# EAGLE design 4-UniverseOutV2 (EAGLE 6.6.0)
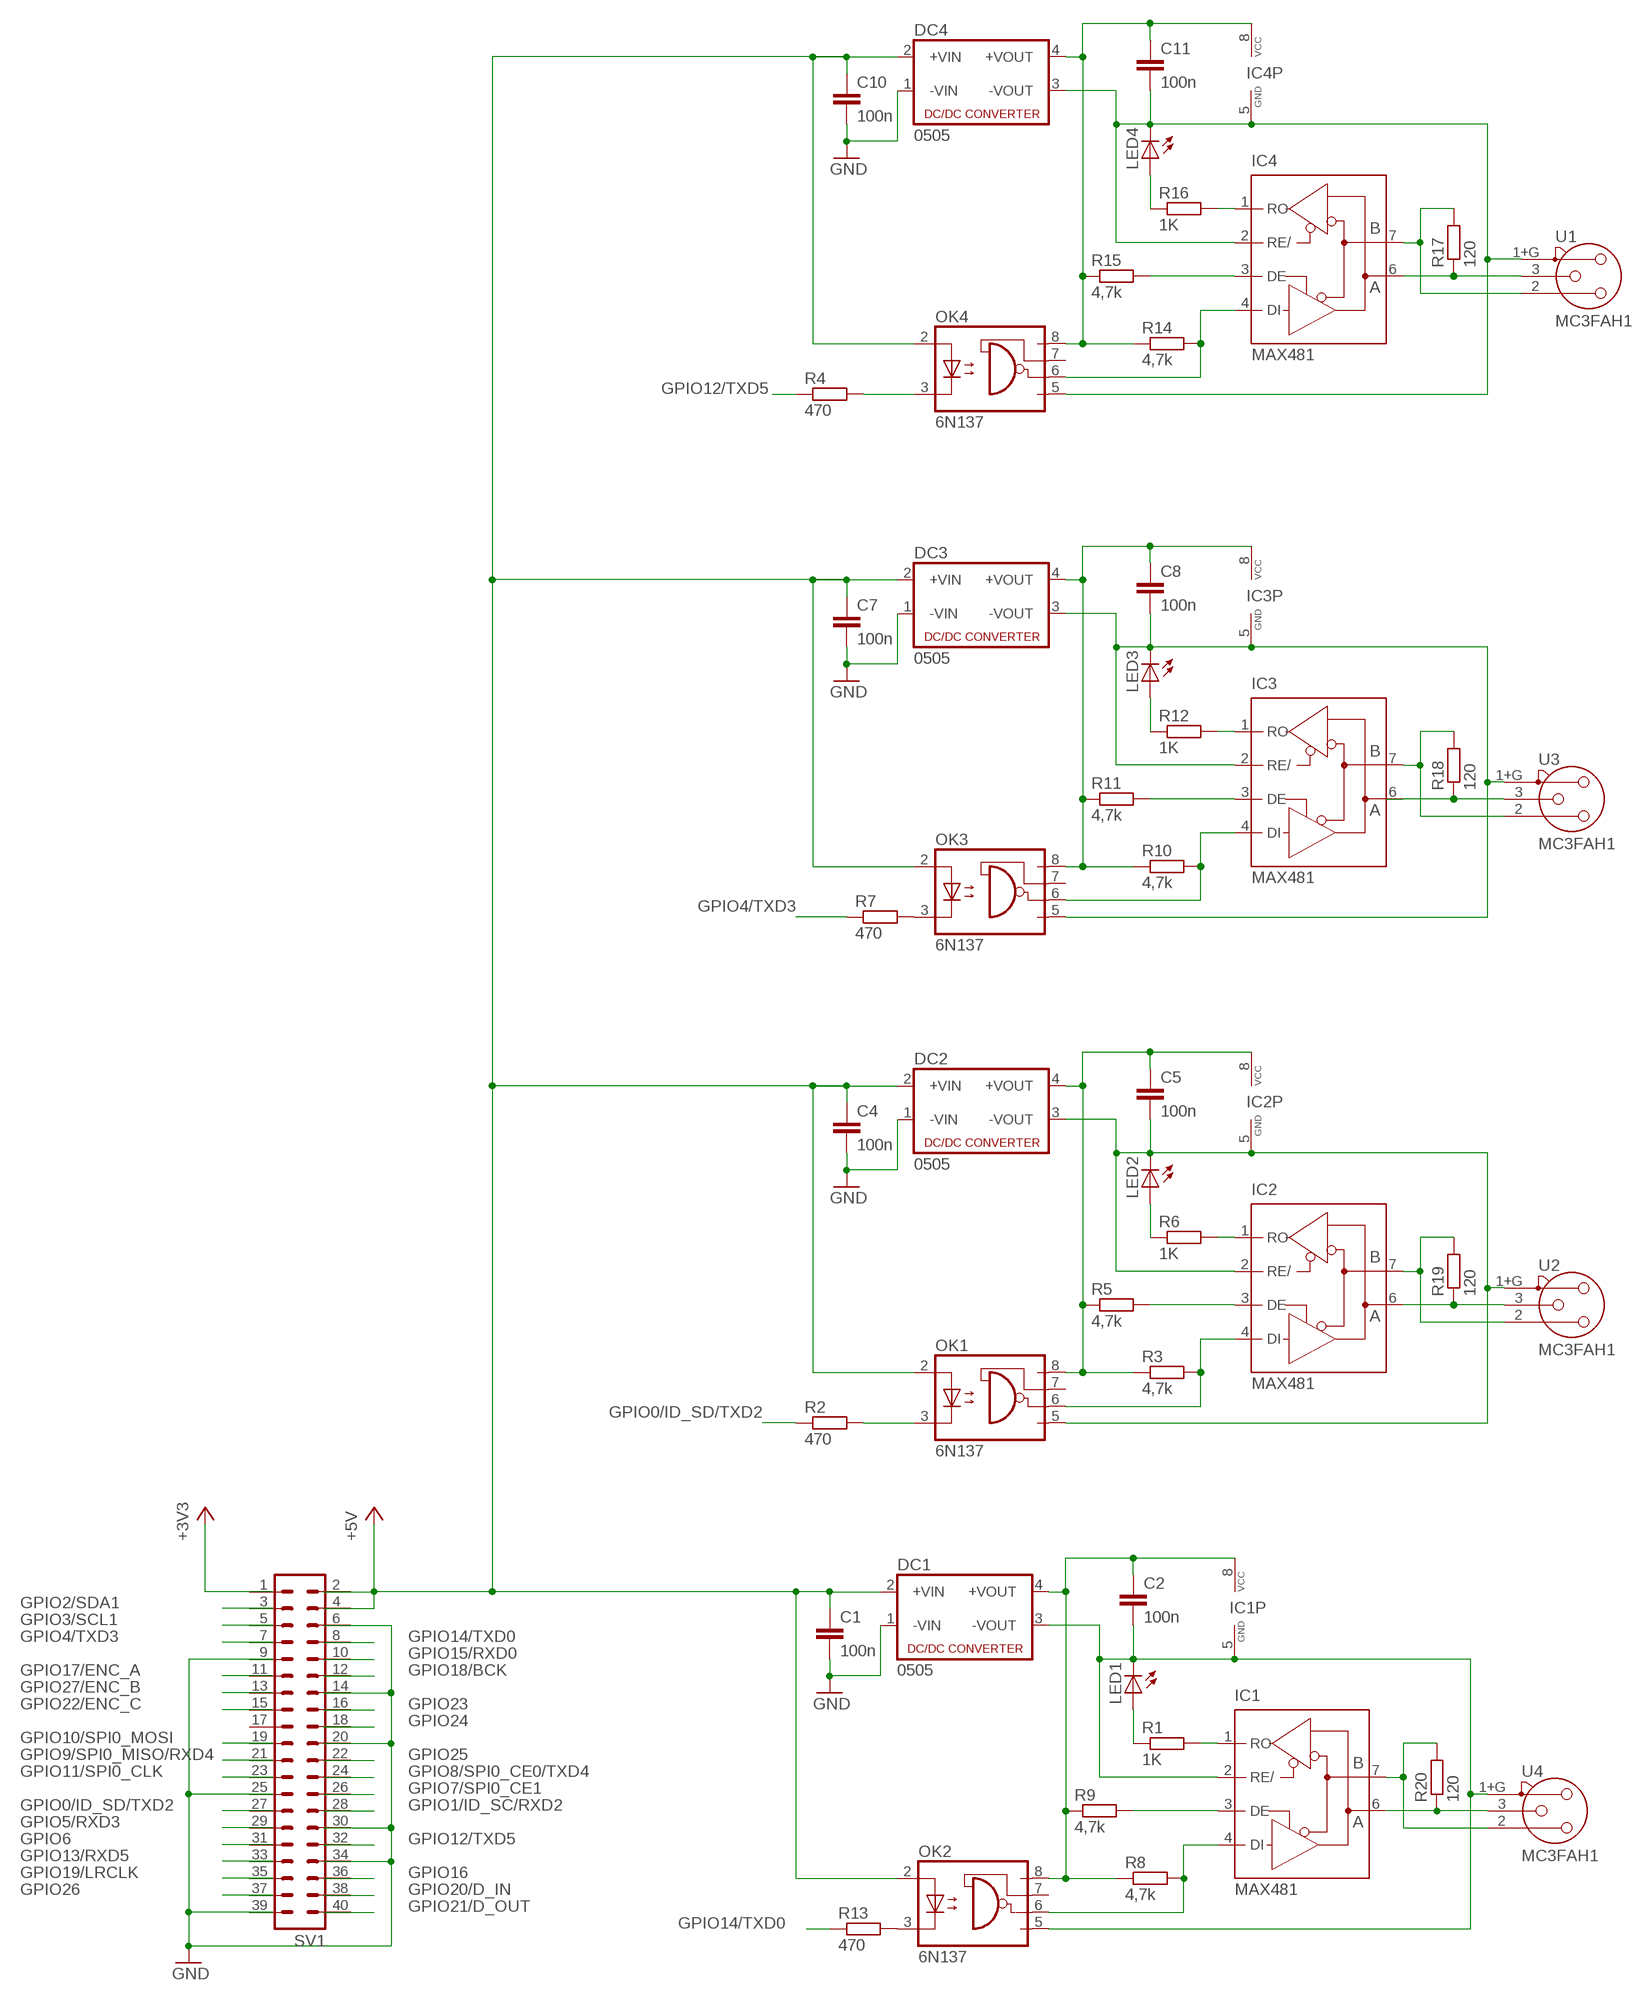
[diagram p0: schematic, sheet 1]

## Parts
C1  100n  C5/3  [C5B3]
C2  100n  C7.5/3  [C7.5B3]
C4  100n  C5/3  [C5B3]
C5  100n  C7.5/3  [C7.5B3]
C7  100n  C5/3  [C5B3]
C8  100n  C7.5/3  [C7.5B3]
C10  100n  C5/3  [C5B3]
C11  100n  C7.5/3  [C7.5B3]
DC1  0505  NME  [NME]
DC2  0505  NME  [NME]
DC3  0505  NME  [NME]
DC4  0505  NME  [NME]
IC1  MAX481  MAX481CPA  [DIL08]
IC2  MAX481  MAX481CPA  [DIL08]
IC3  MAX481  MAX481CPA  [DIL08]
IC4  MAX481  MAX481CPA  [DIL08]
LED1  LED3MM  [LED3MM]
LED2  LED3MM  [LED3MM]
LED3  LED3MM  [LED3MM]
LED4  LED3MM  [LED3MM]
OK1  6N137  [DIL08]
OK2  6N137  [DIL08]
OK3  6N137  [DIL08]
OK4  6N137  [DIL08]
R1  1K  R-EU_0204/7  [0204/7]
R2  470  R-EU_0204/7  [0204/7]
R3  4,7k  R-EU_0204/7  [0204/7]
R4  470  R-EU_0204/7  [0204/7]
R5  4,7k  R-EU_0204/7  [0204/7]
R6  1K  R-EU_0204/7  [0204/7]
R7  470  R-EU_0204/7  [0204/7]
R8  4,7k  R-EU_0204/7  [0204/7]
R9  4,7k  R-EU_0204/7  [0204/7]
R10  4,7k  R-EU_0204/7  [0204/7]
R11  4,7k  R-EU_0204/7  [0204/7]
R12  1K  R-EU_0204/7  [0204/7]
R13  470  R-EU_0204/7  [0204/7]
R14  4,7k  R-EU_0204/7  [0204/7]
R15  4,7k  R-EU_0204/7  [0204/7]
R16  1K  R-EU_0204/7  [0204/7]
R17  120  R-EU_0207/2V  [0207/2V]
R18  120  R-EU_0207/2V  [0207/2V]
R19  120  R-EU_0207/2V  [0207/2V]
R20  120  R-EU_0207/2V  [0207/2V]
SV1  ML40  [ML40]
U1  MC3FAH1  [NC3FAH1]
U2  MC3FAH1  [NC3FAH1]
U3  MC3FAH1  [NC3FAH1]
U4  MC3FAH1  [NC3FAH1]

## Nets
+3V3: SV1.1
+5V: C1.1 C4.1 C7.1 C10.1 DC1.2(+VIN) DC2.2(+VIN) DC3.2(+VIN) DC4.2(+VIN) OK1.2(A) OK2.2(A) OK3.2(A) OK4.2(A) SV1.2 SV1.4
+5V_EXT: C2.1 DC1.4(+VOUT) IC1.8(VCC) OK2.8(VCC) R8.1 R9.1
+5V_EXT1: C5.1 DC2.4(+VOUT) IC2.8(VCC) OK1.8(VCC) R3.1 R5.1
+5V_EXT2: C8.1 DC3.4(+VOUT) IC3.8(VCC) OK3.8(VCC) R10.1 R11.1
+5V_EXT3: C11.1 DC4.4(+VOUT) IC4.8(VCC) OK4.8(VCC) R14.1 R15.1
GND: C1.2 C4.2 C7.2 C10.2 DC1.1(-VIN) DC2.1(-VIN) DC3.1(-VIN) DC4.1(-VIN) SV1.6 SV1.9 SV1.14 SV1.20 SV1.25 SV1.30 SV1.34 SV1.39
GND_EXT: C2.2 DC1.3(-VOUT) IC1.2(RE/) IC1.5(GND) LED1.K(C) OK2.5(GND) U4.1+G
GND_EXT1: C5.2 DC2.3(-VOUT) IC2.2(RE/) IC2.5(GND) LED2.K(C) OK1.5(GND) U2.1+G
GND_EXT2: C8.2 DC3.3(-VOUT) IC3.2(RE/) IC3.5(GND) LED3.K(C) OK3.5(GND) U3.1+G
GND_EXT3: C11.2 DC4.3(-VOUT) IC4.2(RE/) IC4.5(GND) LED4.K(C) OK4.5(GND) U1.1+G
GPIO0/ID_SD/TXD2: R2.1 SV1.27
GPIO1/ID_SC/RXD2: SV1.28
GPIO2/SDA1: SV1.3
GPIO3/SCL1: SV1.5
GPIO4/TXD3: R7.1 SV1.7
GPIO5/RXD3: SV1.29
GPIO6: SV1.31
GPIO7/SPI0_CE1: SV1.26
GPIO8/SPI0_CE0/TXD4: SV1.24
GPIO9/SPI0_MISO/RXD4: SV1.21
GPIO10/SPI0_MOSI: SV1.19
GPIO11/SPI0_CLK: SV1.23
GPIO12/TXD5: R4.1 SV1.32
GPIO13/RXD5: SV1.33
GPIO14/TXD0: R13.1 SV1.8
GPIO15/RXD0: SV1.10
GPIO16: SV1.36
GPIO17/ENC_A: SV1.11
GPIO18/BCK: SV1.12
GPIO19/LRCLK: SV1.35
GPIO20/D_IN: SV1.38
GPIO21/D_OUT: SV1.40
GPIO22/ENC_C: SV1.15
GPIO23: SV1.16
GPIO24: SV1.18
GPIO25: SV1.22
GPIO26: SV1.37
GPIO27/ENC_B: SV1.13
N$1: OK4.3(C) R4.2
N$2: OK3.3(C) R7.2
N$3: OK1.3(C) R2.2
N$4: OK2.3(C) R13.2
N$36: IC1.3(DE) R9.2
N$87: IC1.4(DI) OK2.6(VO) R8.2
N$161: IC1.6(A) R20.1 U4.3
N$162: IC1.7(B) R20.2 U4.2
N$164: IC1.1(RO) R1.2
N$165: LED1.A R1.1
N$167: IC2.3(DE) R5.2
N$168: IC2.4(DI) OK1.6(VO) R3.2
N$169: IC2.6(A) R19.1 U2.3
N$170: IC2.7(B) R19.2 U2.2
N$172: IC2.1(RO) R6.2
N$173: LED2.A R6.1
N$177: IC3.3(DE) R11.2
N$178: IC3.4(DI) OK3.6(VO) R10.2
N$179: IC3.6(A) R18.1 U3.3
N$181: IC3.7(B) R18.2 U3.2
N$187: IC3.1(RO) R12.2
N$188: LED3.A R12.1
N$191: IC4.3(DE) R15.2
N$192: IC4.4(DI) OK4.6(VO) R14.2
N$193: IC4.6(A) R17.1 U1.3
N$194: IC4.7(B) R17.2 U1.2
N$196: IC4.1(RO) R16.2
N$197: LED4.A R16.1
Unconnected: OK1.7(VE) OK2.7(VE) OK3.7(VE) OK4.7(VE) SV1.17

## Library data of the parts
C1 C2 C4 C5 C7 C8 C10 C11 = capacitor-wima:C: CAPACITOR naming: grid - package width
DC1-DC4 = dc-dc-converter:NME: DC-DC CONVERTER; MF: C & D TECHNOLOGIES, INC; MPN: NME1205D; OC_FARNELL: 1021466; OC_NEWARK: 98B8198
IC1-IC4 = maxim:MAX481CPA: RS485 TRANSEIVER; MPN: MAX481CPA+; OC_FARNELL: unknown; OC_NEWARK: 99K3445
LED1-LED4 = led:LED: LED OSRAM: - CHIPLED LG R971, LG N971, LY N971, LG Q971, LY Q971, LO R971, LY R971 LH N974, LH R974 LS Q976, LO Q976, LY Q976 LO Q996 - Hyper CHIPLED LW Q18S LB Q993, LB Q99A, LB R99A - SideLED LS A670, LO A670, LY A670, LG A670, LP A670 LB A673, LV A673, LT A673, LW A673 LH A674 LY A675 LS A676, LA A676, LO A676, LY A676, LW A676 LS A679, LY A679, LG A679 - Hyper Micro SIDELED® LS Y876, LA Y876, LO Y876, LY Y876 LT Y87S - SmartLED LW L88C, LW L88S LB L89C, LB L89S, LG L890 LS L89K, LO L89K, LY L89K LS L896, LA L896, LO L896, LY L896 - TOPLED LS T670, LO T670, LY T670, LG T670, LP T670 LSG T670, LSP T670, LSY T670, LOP T670, LYG T670 LG T671, LOG T671, LSG T671 LB T673, LV T673, LT T673, LW T673 LH T674 LS T676, LA T676, LO T676, LY T676, LB T676, LH T676, LSB T676, LW T676 LB T67C, LV T67C, LT T67C, LS T67K, LO T67K, LY T67K, LW E67C LS E67B, LA E67B, LO E67B, LY E67B, LB E67C, LV E67C, LT E67C LW T67C LS T679, LY T679, LG T679 LS T770, LO T770, LY T770, LG T770, LP T770 LB T773, LV T773, LT T773, LW T773 LH T774 LS E675, LA E675, LY E675, LS T675 LS T776, LA T776, LO T776, LY T776, LB T776 LHGB T686 LT T68C, LB T68C - Hyper Mini TOPLED® LB M676 - Mini TOPLED Santana® LG M470 LS M47K, LO M47K, LY M47K Source: http://www.osram.convergy.de LUXEON: - LUMILED® LXK2-PW12-R00, LXK2-PW12-S00, LXK2-PW14-U00, LXK2-PW14-V00 LXK2-PM12-R00, LXK2-PM12-S00, LXK2-PM14-U00 LXK2-PE12-Q00, LXK2-PE12-R00, LXK2-PE12-S00, LXK2-PE14-T00, LXK2-PE14-U00 LXK2-PB12-K00, LXK2-PB12-L00, LXK2-PB12-M00, LXK2-PB14-N00, LXK2-PB14-P00, LXK2-PB14-Q00 LXK2-PR12-L00, LXK2-PR12-M00, LXK2-PR14-Q00, LXK2-PR14-R00 LXK2-PD12-Q00, LXK2-PD12-R00, LXK2-PD12-S00 LXK2-PH12-R00, LXK2-PH12-S00 LXK2-PL12-P00, LXK2-PL12-Q00, LXK2-PL12-R00 Source: www.luxeon.com KINGBRIGHT: KA-3528ASYC Source: www.kingbright.com
OK1-OK4 = optocoupler:6N137: MOTOROLA OPTO COUPLER; MPN: 6N137; OC_FARNELL: 1328376; OC_NEWARK: 52M1895
R1-R20 = resistor:R-EU_: RESISTOR, European symbol
SV1 = con-ml:ML40: HARTING; OC_FARNELL: unknown; OC_NEWARK: unknown
U1-U4 = con-neutrik_ag:MC3?: Neutrik Audio Connector XLR SERIES Stereo 1/4" jack Source: www.neutrik.com/; OC_FARNELL: unknown; OC_NEWARK: unknown

## Board
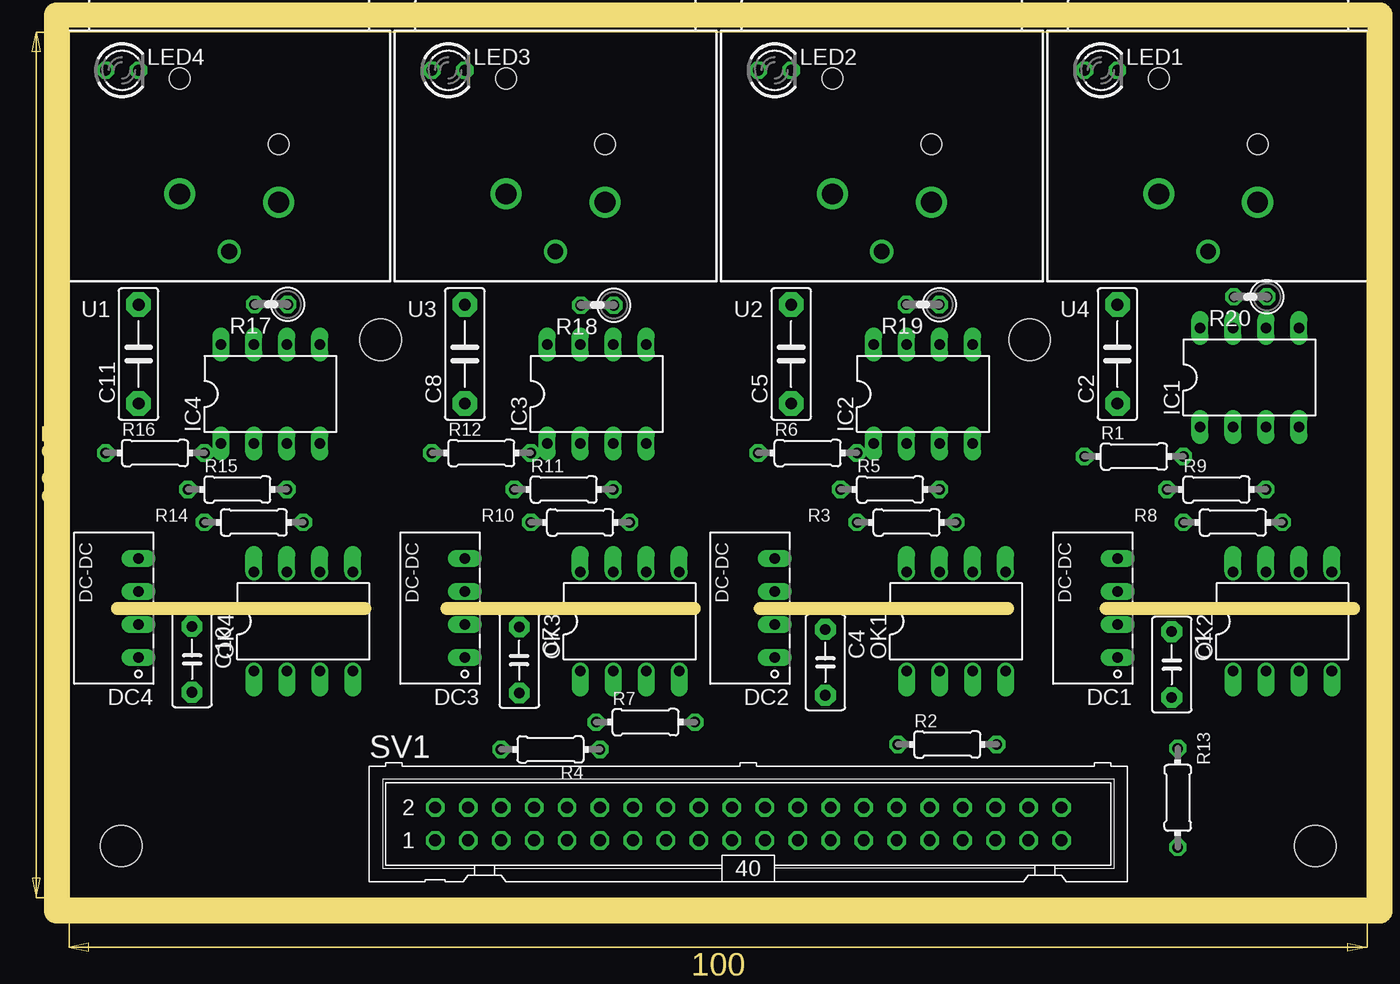
[diagram p1: board, top side]
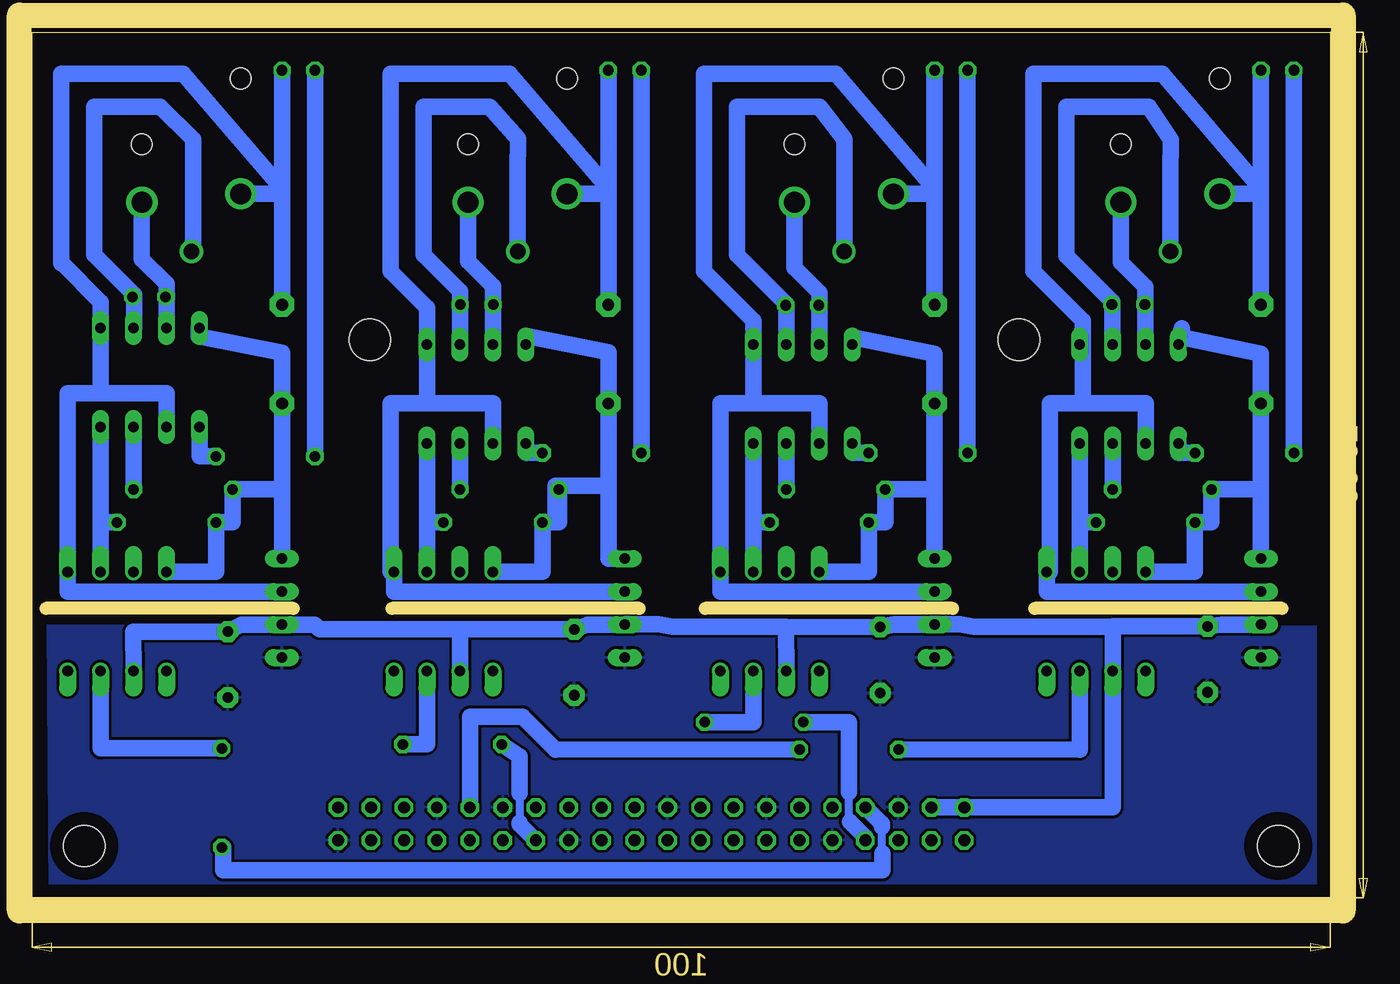
[diagram p2: board, bottom side, seen from below]

Size 100 x 66.67 mm. Coordinates in mm from the lower left corner, seen from the top.
Outline: 0,0 100,0 100,66.67 0,66.67 0,0
Copper layers (1*16): Top 0.035mm / dielectric 1.5mm / Bottom 0.035mm
Design rules "default *": minimum track width 20mil, minimum drill 24mil, track to track 8mil, track to pad 8mil, pad to pad 8mil, via to via 8mil, smd to smd 8mil, copper to edge 40mil, drill to drill 8mil, minimum pad ring 10mil, minimum via ring 8mil, stop-mask expansion 4mil, vias tented up to drill 0mil, thermal gap 10mil
Holes 3.2 mm at 96,4 4,4 74,43 24,43
Milling: 8 lines

### Footprints (pad centres in the part's own frame; a part is rotated, then mirrored left to right if it is on the bottom)
C5B3 = drill 0.813 pad 1.6 octagon: 1 -2.54,0; 2 2.54,0
C7.5B3 = drill 0.914 pad 1.905 octagon: 1 -3.81,0; 2 3.81,0
NME = drill 0.813 long: 1 0,3.81; 2 0,1.27; 3 0,-1.27; 4 0,-3.81
DIL08 = drill 0.813 long: 1 -3.81,-3.81; 2 -1.27,-3.81; 3 1.27,-3.81; 4 3.81,-3.81; 5 3.81,3.81; 6 1.27,3.81; 7 -1.27,3.81; 8 -3.81,3.81
LED3MM = drill 0.813 octagon: A -1.27,0; K 1.27,0
DIL08' = drill 0.813 offset: 1 -3.81,-3.81; 2 -1.27,-3.81; 3 1.27,-3.81; 4 3.81,-3.81; 5 3.81,3.81; 6 1.27,3.81; 7 -1.27,3.81; 8 -3.81,3.81
0204/7 = drill 0.813 octagon: 1 -3.81,0; 2 3.81,0
0207/2V = drill 0.813 octagon: 1 -1.27,0; 2 1.27,0
ML40 = drill 0.914 octagon: 1 -24.13,-1.27; 2 -24.13,1.27; 3 -21.59,-1.27; 4 -21.59,1.27; 5 -19.05,-1.27; 6 -19.05,1.27; 7 -16.51,-1.27; 8 -16.51,1.27; 9 -13.97,-1.27; 10 -13.97,1.27; 11 -11.43,-1.27; 12 -11.43,1.27; 13 -8.89,-1.27; 14 -8.89,1.27; 15 -6.35,-1.27; 16 -6.35,1.27; 17 -3.81,-1.27; 18 -3.81,1.27; 19 -1.27,-1.27; 20 -1.27,1.27; 21 1.27,-1.27; 22 1.27,1.27; 23 3.81,-1.27; 24 3.81,1.27; 25 6.35,-1.27; 26 6.35,1.27; 27 8.89,-1.27; 28 8.89,1.27; 29 11.43,-1.27; 30 11.43,1.27; 31 13.97,-1.27; 32 13.97,1.27; 33 16.51,-1.27; 34 16.51,1.27; 35 19.05,-1.27; 36 19.05,1.27; 37 21.59,-1.27; 38 21.59,1.27; 39 24.13,-1.27; 40 24.13,1.27
NC3FAH1 = drill 1.6: 1+G -3.81,0.635; 2 3.81,0 | drill 1.2: 3 0,-3.815 | hole 1.6: -3.81,9.525; 3.81,4.445

### Placement (x,y rotation side)
C1  84.95,17.97 270 top
C2  80.77,41.89 90 top
C4  58.26,18.15 270 top
C5  55.63,41.89 90 top
C7  34.68,18.32 270 top
C8  30.48,41.89 90 top
C10  9.46,18.38 270 top
C11  5.33,41.89 90 top
DC1  80.77,22.32 180 top
DC2  54.36,22.32 180 top
DC3  30.48,22.32 180 top
DC4  5.33,22.32 180 top
IC1  90.93,40.08 0 top
IC2  65.79,38.81 0 top
IC3  40.64,38.81 0 top
IC4  15.49,38.81 0 top
LED1  79.5,63.75 0 top
LED2  54.36,63.75 0 top
LED3  29.21,63.75 0 top
LED4  4.06,63.75 0 top
OK1  6N137  [DIL08']  68.33,21.3 0 top
OK2  6N137  [DIL08']  93.47,21.3 0 top
OK3  6N137  [DIL08']  43.18,21.3 0 top
OK4  6N137  [DIL08']  18.03,21.3 0 top
R1  82.04,34 0 top
R2  67.65,11.82 0 top
R3  64.52,28.92 0 top
R4  37.08,11.44 180 top
R5  63.25,31.46 0 top
R6  56.9,34.27 0 top
R7  44.4,13.54 0 top
R8  89.66,28.92 0 top
R9  88.39,31.46 0 top
R10  39.37,28.92 0 top
R11  38.1,31.46 0 top
R12  31.75,34.27 0 top
R13  85.41,7.71 90 top
R14  14.22,28.92 0 top
R15  12.95,31.46 0 top
R16  6.6,34.27 0 top
R17  15.55,45.71 180 top
R18  40.69,45.65 180 top
R19  65.77,45.7 180 top
R20  91.02,46.3 180 top
SV1  52.32,5.7 0 top
U1  12.32,53.59 0 top
U2  62.61,53.59 0 top
U3  37.47,53.59 0 top
U4  87.76,53.59 0 top

### Tracks (layer width: path | path; a pad name or v marks a point on that pad's centre or on a via)
+5V
  Bottom 1.27: SV1.4 SV1.2 16.76,6.97 OK4.2 16.75,20.91 | DC4.2 8.37,21.05 C10.1 16.75,20.91 | DC3.2 33.64,21.05 C7.1 | C7.1 41.93,20.88 | 41.93,20.88 OK3.2 | 67.06,20.71 C4.1 57.24,21.05 DC2.2 54.34,21.06 51.77,21.06 50.7,20.89 41.93,20.88 | 67.06,20.71 OK1.2 | OK2.2 92.23,20.52 C1.1 83.93,21.05 DC1.2 78.26,21.06 77.88,20.7 67.06,20.71 | C7.1 34.69,20.9 33.57,21.06 28.53,21.06 27.45,20.89 16.84,20.89 16.75,20.91
+5V_EXT
  Bottom 1.27: OK2.8 85.85,25.11 R8.1 | R8.1 84.58,28.92 R9.1 80.77,31.46 | R8.1 84.58,28.92 84.58,31.43 | DC1.4 80.77,31.46 | 80.77,31.46 C2.1 80.77,42 87.21,43.27 87.21,43.89 IC1.8
+5V_EXT1
  Bottom 1.27: OK1.8 60.71,25.11 R3.1 59.69,28.92 | R5.1 59.44,28.92 59.69,28.92 | DC2.4 55.63,26.13 55.63,31.75 | 55.63,31.75 C5.1 55.63,42.05 61.98,43.32 IC2.8 | 59.69,28.92 59.69,31.75 55.63,31.75
+5V_EXT2
  Bottom 1.27: IC3.8 36.83,43.18 30.48,41.91 C8.1 30.48,31.46 | 30.48,31.46 R11.1 34.29,28.92 R10.1 35.56,25.11 OK3.8 | DC3.4 30.48,31.46
+5V_EXT3
  Bottom 1.27: OK4.8 10.41,25.11 R14.1 9.14,28.92 R15.1 5.33,31.46 C11.1 | C11.1 5.34,38.08 5.34,26.26 5.33,26.26 DC4.4 | IC4.8 11.43,43.89 11.43,43.18 5.33,41.91 C11.1
GND
  pour Bottom: 0,0 98.76,0.09 98.9,21.06 0.14,20.97
GND_EXT
  Bottom 1.27: U4.1+G 80.77,54.23 | 80.77,54.23 80.77,54.61 | 80.77,54.61 LED1.K | 80.77,54.23 C2.2 | DC1.3 97.28,23.59 OK2.5 97.3,25.11 97.3,38.86 94.74,38.86 | 94.74,38.86 IC1.5 | 94.74,38.86 94.73,38.86 | IC1.2 89.66,38.86 94.73,38.86 | 94.73,38.86 94.73,45.88 97.72,48.88 97.79,48.88 97.79,63.5 88.39,63.5 80.77,54.61
GND_EXT1
  Bottom 1.27: 55.63,54.23 55.63,54.61 | 55.63,54.61 LED2.K | U2.1+G 55.63,54.23 | 55.63,54.23 C5.2 | DC2.3 72.14,23.59 OK1.5 72.39,25.11 72.39,38.1 69.6,38.1 | 69.6,38.1 IC2.5 | 69.6,38.1 69.59,38.1 | IC2.2 64.52,38.1 69.59,38.1 | 69.59,38.1 69.59,45.46 72.39,48.26 72.39,63.5 63.25,63.5 55.63,54.61
GND_EXT2
  Bottom 1.27: 30.48,54.23 30.48,54.61 | 30.48,54.61 LED3.K | U3.1+G 30.48,54.23 | 30.48,54.23 C8.2 | DC3.3 46.99,23.59 OK3.5 46.99,38.1 44.45,38.1 | 44.45,38.1 IC3.5 44.45,44.45 48.26,48.26 48.26,63.5 38.1,63.5 30.48,54.61 | IC3.2 39.37,38.1 44.45,38.1
GND_EXT3
  Bottom 1.27: U1.1+G 5.33,54.23 | 5.33,54.23 5.33,54.61 | 5.33,54.61 LED4.K | 5.33,54.23 C11.2 | DC4.3 21.84,23.59 OK4.5 21.59,25.11 21.59,38.1 19.05,38.1 | IC4.2 14.22,38.1 19.05,38.1 | IC4.5 19.05,43.89 | 19.05,43.89 19.05,38.1 | 19.05,43.89 19.05,44.45 22.86,48.26 22.86,63.5 12.95,63.5 5.33,54.61
GPIO0/ID_SD/TXD2
  Bottom 0.61: 62.47,8.07 62.47,5.8
  Bottom 1.016: 62.45,8.07 62.47,8.07
  Bottom 1.27: R2.1 62.45,10.89 62.45,8.07 | 62.47,5.8 62.47,5.69 SV1.27
GPIO4/TXD3
  Bottom 0.61: 37.08,5.88 37.08,8.13
  Bottom 1.016: 37.02,5.88 37.08,5.88
  Bottom 1.27: SV1.7 35.81,4.67 37.02,5.88 | 37.08,8.13 37.1,8.13 37.1,13.54 R7.1
GPIO12/TXD5
  Bottom 1.27: R4.1 59.69,11.43 62.23,13.97 66.29,13.97 SV1.32
GPIO14/TXD0
  Bottom 0.61: 34.54,3.56 34.54,5.5
  Bottom 1.016: 34.52,3.44 34.54,3.56
  Bottom 1.27: R13.1 85.3,3.9 85.3,2.11 34.52,2.11 34.52,3.44 | 34.54,5.5 34.55,5.7 SV1.8
N$1
  Bottom 1.27: R4.2 19.3,11.43 OK4.3
N$2
  Bottom 1.27: R7.2 44.45,13.54 OK3.3
N$3
  Bottom 1.27: R2.2 69.61,11.84 OK1.3
N$4
  Bottom 1.27: R13.2 94.74,11.52 OK2.3
N$36
  Bottom 1.27: IC1.3 R9.2
N$87
  Bottom 1.27: IC1.4 94.74,29.21 94.74,28.92 | 94.74,28.92 OK2.6 | R8.2 94.74,28.92
N$161
  Bottom 0.406: R20.1 92.2,46.3 IC1.6
  Bottom 1.27: IC1.6 92.17,43.89 92.17,46.45 95.25,49.53 95.25,60.96 90.17,60.96 87.63,58.42 87.63,49.91 U4.3
N$162
  Bottom 0.406: R20.2 89.67,46.3 89.67,44.45
  Bottom 1.27: U4.2 91.57,49.2 89.67,47.31 89.67,44.45 89.67,43.9 IC1.7
N$164
  Bottom 1.27: R1.2 87.12,34 IC1.1
N$165
  Bottom 1.27: LED1.A R1.1
N$167
  Bottom 1.27: IC2.3 R5.2
N$168
  Bottom 1.27: OK1.6 69.6,28.92 | 69.6,28.92 IC2.4 | R3.2 69.6,28.92
N$169
  Bottom 0.406: R19.1 67.06,46.25 IC2.6
  Bottom 1.27: IC2.6 67.06,46.74 69.85,49.53 69.85,60.96 64.77,60.96 62.58,58.47 62.58,57.2 62.61,57.15 U2.3
N$170
  Bottom 0.406: R19.2 64.49,46.25 64.49,44.45
  Bottom 1.27: U2.2 66.42,49.05 64.49,47.12 64.49,44.45 64.49,43.92 IC2.7
N$172
  Bottom 1.27: R6.2 61.98,34.27 IC2.1
N$173
  Bottom 1.27: LED2.A R6.1
N$177
  Bottom 1.27: IC3.3 R11.2
N$178
  Bottom 1.27: R10.2 44.45,28.92 | 44.45,28.92 OK3.6 | IC3.4 44.45,28.92
N$179
  Bottom 0.406: R18.1 41.91,46.26 41.91,44.45
  Bottom 1.27: IC3.6 41.91,44.45 41.91,45.72 45.72,49.53 45.72,60.96 39.37,60.96 37.42,58.45 37.42,57.18 37.42,57.15 37.42,50.41 U3.3
N$181
  Bottom 0.406: R18.2 39.35,46.26 39.35,44.45
  Bottom 1.27: U3.2 41.27,48.53 39.35,46.6 39.35,44.45 39.35,43.91 IC3.7
N$187
  Bottom 1.27: IC3.1 36.83,34.29 35.56,34.29 R12.2
N$188
  Bottom 1.27: LED3.A R12.1
N$191
  Bottom 1.27: R15.2 IC4.3
N$192
  Bottom 1.27: 19.3,28.92 IC4.4 | R14.2 19.3,28.92 | 19.3,28.92 OK4.6
N$193
  Bottom 0.406: R17.1 16.77,46.26 16.77,44.45
  Bottom 1.27: U1.3 12.3,49.72 12.3,57.09 12.28,57.12 12.28,58.39 13.97,60.96 20.32,60.96 20.32,49.48 16.77,45.93 16.77,44.45 16.77,43.9 IC4.6
N$194
  Bottom 0.406: R17.2 IC4.7
  Bottom 1.27: U1.2 16.13,48.97 14.23,47.07 14.23,43.9 IC4.7
N$196
  Bottom 1.27: R16.2 11.68,34.27 IC4.1
N$197
  Bottom 1.27: LED4.A R16.1